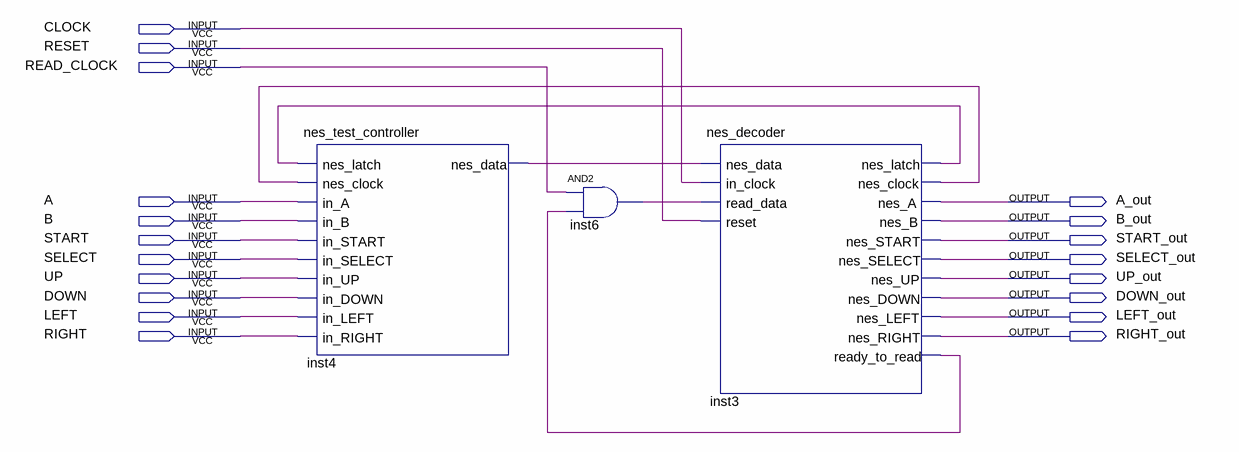
[diagram p0: schematic sheet]
// Quartus schematic nes_test.bdf as structural Verilog: 3 symbols, 19 pins
module nes_test (
  input  CLOCK,
  input  RESET,
  input  READ_CLOCK,
  input  A,
  input  B,
  input  START,
  input  SELECT,
  input  UP,
  input  DOWN,
  input  LEFT,
  input  RIGHT,
  output A_out,
  output B_out,
  output START_out,
  output SELECT_out,
  output UP_out,
  output DOWN_out,
  output LEFT_out,
  output RIGHT_out
);

  wire inst3_nes_clock, inst3_nes_latch, inst3_ready_to_read, inst4_nes_data, inst6_out;

  nes_test_controller inst4 (
    .nes_latch(inst3_nes_latch), .nes_clock(inst3_nes_clock), .in_A(A), .in_B(B), .in_START(START),
    .in_SELECT(SELECT), .in_UP(UP), .in_DOWN(DOWN), .in_LEFT(LEFT), .in_RIGHT(RIGHT),
    .nes_data(inst4_nes_data));
  and inst6 (inst6_out, READ_CLOCK, inst3_ready_to_read);
  nes_decoder inst3 (
    .nes_data(inst4_nes_data), .in_clock(CLOCK), .read_data(inst6_out), .reset(RESET),
    .nes_latch(inst3_nes_latch), .nes_clock(inst3_nes_clock), .nes_A(A_out), .nes_B(B_out),
    .nes_START(START_out), .nes_SELECT(SELECT_out), .nes_UP(UP_out), .nes_DOWN(DOWN_out),
    .nes_LEFT(LEFT_out), .nes_RIGHT(RIGHT_out), .ready_to_read(inst3_ready_to_read));
endmodule
